# EAGLE design BRPBARS4CH (EAGLE 9.6.2)
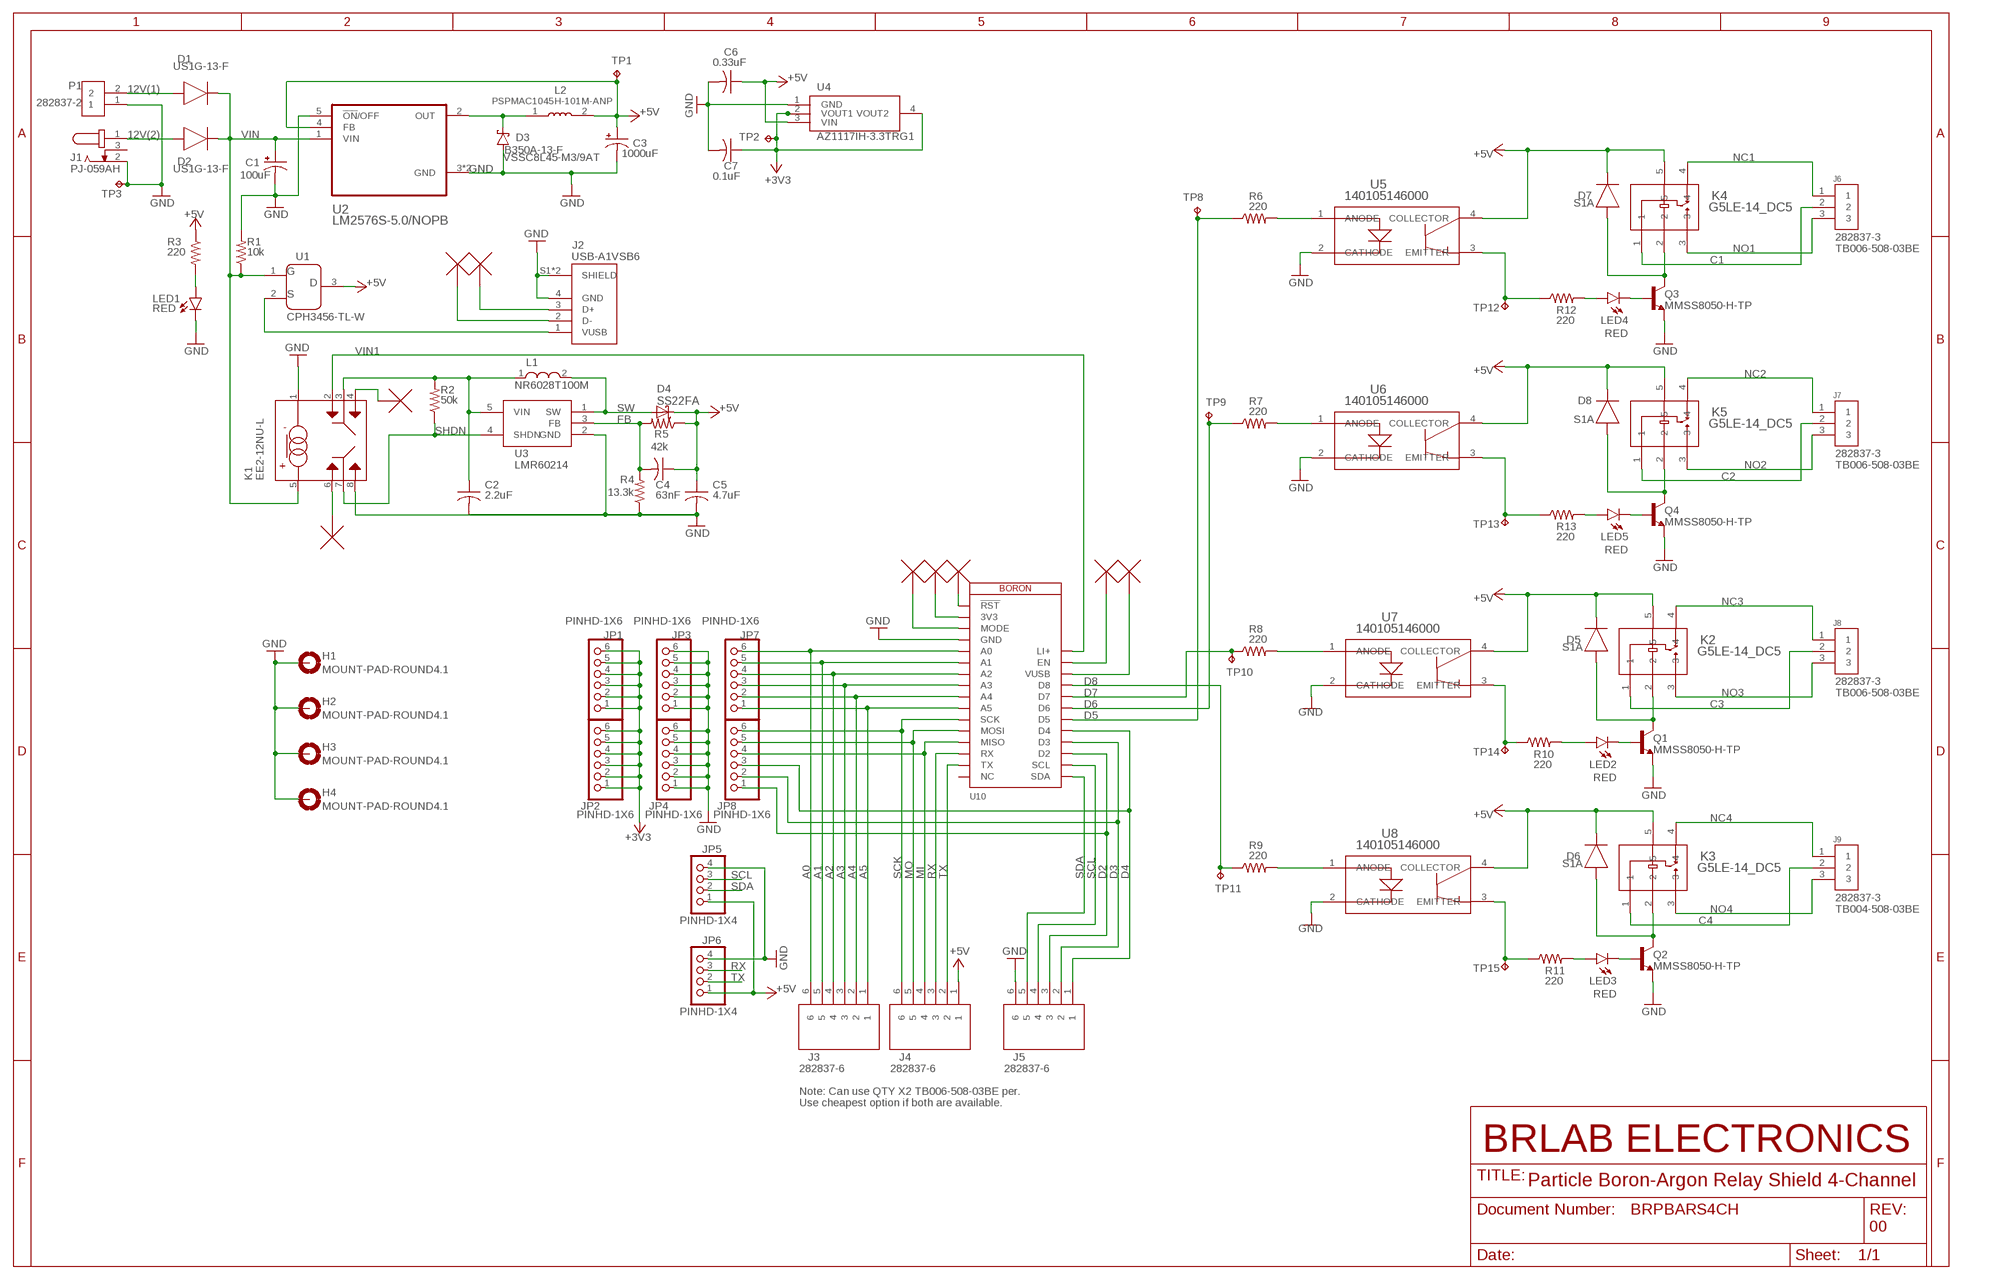
[diagram p0: schematic, sheet 1]

## Parts
C1  100uF  CPOL-US153CLV-0605  [153CLV-0605]
C2  2.2uF  C-USC0805  [C0805]
C3  1000uF  CPOL-US153CLV-0810  [153CLV-0810]
C4  63nF  C-USC0805  [C0805]
C5  4.7uF  C-USC0805  [C0805]
C6  0.33uF  C-USC1206  [C1206]
C7  0.1uF  C-USC1206  [C1206]
D1  RS1G-13-F  DIODE_RS1G-13-F_SMA  [DIOM5226X290N]
D2  RS1G-13-F  DIODE_RS1G-13-F_SMA  [DIOM5226X290N]
D3  B350A-13-F  SCHOTTKY-DIODESMD  [SMB]
D4  SS22FA  [SS22FA]
D5  DIODE  DIODEDO-214AC(SMA)  [DIOM5226X290N]
D6  DIODE  DIODEDO-214AC(SMA)  [DIOM5226X290N]
D7  DIODE  DIODEDO-214AC(SMA)  [DIOM5226X290N]
D8  DIODE  DIODEDO-214AC(SMA)  [DIOM5226X290N]
H1  MOUNT-PAD-ROUND4.1  [4,1-PAD]
H2  MOUNT-PAD-ROUND4.1  [4,1-PAD]
H3  MOUNT-PAD-ROUND4.1  [4,1-PAD]
H4  MOUNT-PAD-ROUND4.1  [4,1-PAD]
J1  PJ-059AH  [CUI_PJ-059AH]
J2  USB-A1VSB6  [ONSHORE_USB-A1VSB6]
J3  282837-6  [TE_282837-6]
J4  282837-6  [TE_282837-6]
J5  282837-6  [TE_282837-6]
J6  282837-3  [TE_282837-3]
J7  282837-3  [TE_282837-3]
J8  282837-3  [TE_282837-3]
J9  282837-3  [TE_282837-3]
JP1  PINHD-1X6  [1X06]
JP2  PINHD-1X6  [1X06]
JP3  PINHD-1X6  [1X06]
JP4  PINHD-1X6  [1X06]
JP5  PINHD-1X4  [1X04]
JP6  PINHD-1X4  [1X04]
JP7  PINHD-1X6  [1X06]
JP8  PINHD-1X6  [1X06]
K1  EE2-12NU-L  [EE2-12NU-L]
K2  G5LE-14_DC5  [RELAY_G5LE-1_DC5_OMR]
K3  G5LE-14_DC5  [RELAY_G5LE-1_DC5_OMR]
K4  G5LE-14_DC5  [RELAY_G5LE-1_DC5_OMR]
K5  G5LE-14_DC5  [RELAY_G5LE-1_DC5_OMR]
L1  NR6028T100M  [NR6028T100M]
L2  100uH  PSPMAC1045H-101M-ANP  [PSPMAC1045H-101M-ANP]
LED1  RED  LEDCHIPLED_1206  [CHIPLED_1206]
LED2  RED  LEDCHIPLED_1206  [CHIPLED_1206]
LED3  RED  LEDCHIPLED_1206  [CHIPLED_1206]
LED4  RED  LEDCHIPLED_1206  [CHIPLED_1206]
LED5  RED  LEDCHIPLED_1206  [CHIPLED_1206]
NC1  NC_MARKER  (no package)
NC2  NC_MARKER  (no package)
NC3  NC_MARKER  (no package)
NC4  NC_MARKER  (no package)
P1  282837-2  [TE_282837-2]
Q1  MMSS8050-H-TP  [TRANS_MMSS8050-H-TP]
Q2  MMSS8050-H-TP  [TRANS_MMSS8050-H-TP]
Q3  MMSS8050-H-TP  [TRANS_MMSS8050-H-TP]
Q4  MMSS8050-H-TP  [TRANS_MMSS8050-H-TP]
R1  10k  R-US_R1206  [R1206]
R2  50k  R-US_R0805  [R0805]
R3  220  R-US_R1206  [R1206]
R4  13.3k  R-US_R0805  [R0805]
R5  42k  R-US_R0805  [R0805]
R6  220  R-US_R1206  [R1206]
R7  220  R-US_R1206  [R1206]
R8  220  R-US_R1206  [R1206]
R9  220  R-US_R1206  [R1206]
R10  220  R-US_R1206  [R1206]
R11  220  R-US_R1206  [R1206]
R12  220  R-US_R1206  [R1206]
R13  220  R-US_R1206  [R1206]
TP1  TPB1,27  [B1,27]
TP2  TPB1,27  [B1,27]
TP3  TPB1,27  [B1,27]
TP8  TPB1,27  [B1,27]
TP9  TPB1,27  [B1,27]
TP10  TPB1,27  [B1,27]
TP11  TPB1,27  [B1,27]
TP12  TPB1,27  [B1,27]
TP13  TPB1,27  [B1,27]
TP14  TPB1,27  [B1,27]
TP15  TPB1,27  [B1,27]
U1  CPH3456-TL-W  [CPH3456-TL-W]
U2  LM2576S-5.0/NOPB  [VREG_TPS79625KTTR]
U3  LMR60214  [SOT95P280X145-5N]
U4  AZ1117IH-3.3TRG1  [SOT223]
U5  140105146000  [SO_5146000_WRE]
U6  140105146000  [SO_5146000_WRE]
U7  140105146000  [SO_5146000_WRE]
U8  140105146000  [SO_5146000_WRE]
U10  BORON  [BORON]
U$1  NC_MARKER  (no package)
U$2  NC_MARKER  (no package)
U$3  NC_MARKER  (no package)
U$4  NC_MARKER  (no package)
U$5  NC_MARKER  (no package)

## Nets
12V(1): D1.2(A) P1.2
12V(2): D2.2(A) J1.1
+3V3: C7.1 JP1.1 JP1.2 JP1.3 JP1.4 JP1.5 JP1.6 JP2.1 JP2.2 JP2.3 JP2.4 JP2.5 JP2.6 TP2.TP U4.2(VOUT1) U4.4(VOUT2)
+5V: C3.+ C4.1 C5.1 C6.1 D4.2(C) D5.1(C) D6.1(C) D7.1(C) D8.1(C) J4.1 JP5.1 JP6.1 K2.5 K3.5 K4.5 K5.5 L2.2 R3.1 R5.1 TP1.TP U1.3 U2.4(FB) U4.3(VIN) U5.4(COLLECTOR) U6.4(COLLECTOR) U7.4(COLLECTOR) U8.4(COLLECTOR)
A0: J3.6 JP7.6 U10.5(A0)
A1: J3.5 JP7.5 U10.6(A1)
A2: J3.4 JP7.4 U10.7(A2)
A3: J3.3 JP7.3 U10.8(A3)
A4: J3.2 JP7.2 U10.9(A4)
A5: J3.1 JP7.1 U10.10(A5)
C1: J6.2 K4.1
C2: J7.2 K5.1
C3: J8.2 K2.1
C4: J9.2 K3.1
D2: J5.3 JP8.1 U10.19(D2)
D3: J5.2 JP8.2 U10.20(D3)
D4: J5.1 JP8.3 U10.21(D4)
D5: R6.1 TP8.TP U10.22(D5)
D6: R7.1 TP9.TP U10.23(D6)
D7: R8.1 TP10.TP U10.24(D7)
D8: R9.1 TP11.TP U10.25(D8)
FB: C4.2 R4.2 R5.2 U3.3(FB)
GND [New Class]: C1.- C2.2 C3.- C5.2 C6.2 C7.2 D3.A H1.B4,1(MOUNT) H2.B4,1(MOUNT) H3.B4,1(MOUNT) H4.B4,1(MOUNT) J1.2 J2.4(GND) J2.S1(SHIELD) J2.S2(SHIELD) J5.6 JP3.1 JP3.2 JP3.3 JP3.4 JP3.5 JP3.6 JP4.1 JP4.2 JP4.3 JP4.4 JP4.5 JP4.6 JP5.4 JP6.4 K1.1 K1.8 LED1.C P1.1 Q1.2(E) Q2.2(E) Q3.2(E) Q4.2(E) R1.2 R4.1 TP3.TP U2.3(GND) U2.5(!ON!/OFF) U2.6(GND) U3.2(GND) U4.1(GND) U5.2(CATHODE) U6.2(CATHODE) U7.2(CATHODE) U8.2(CATHODE) U10.4(GND)
MI: J4.4 JP8.4 U10.13(MISO)
MO: J4.5 JP8.5 U10.12(MOSI)
N$1: R12.1 TP12.TP U5.3(EMITTER)
N$2: LED2.A R10.2
N$3: D7.2(A) K4.2 Q3.3(C)
N$4: LED4.C Q3.1(B)
N$5: LED5.C Q4.1(B)
N$6: D8.2(A) K5.2 Q4.3(C)
N$7: LED3.A R11.2
N$8: LED4.A R12.2
N$9: R9.2 U8.1(ANODE)
N$10: R8.2 U7.1(ANODE)
N$11: C2.1 K1.3 L1.1 R2.2 U3.5(VIN)
N$12: LED5.A R13.2
N$13: R11.1 TP15.TP U8.3(EMITTER)
N$14: R10.1 TP14.TP U7.3(EMITTER)
N$15: R6.2 U5.1(ANODE)
N$16: K1.4 NC1.P$1
N$17: U10.27(EN) U$4.P$1
N$18: U10.1(!RST) U$1.P$1
N$19: R13.1 TP13.TP U6.3(EMITTER)
N$20: U10.26(VUSB) U$5.P$1
N$21: LED1.A R3.2
N$22: U10.2(3V3) U$2.P$1
N$23: U10.3(MODE) U$3.P$1
N$24: J2.1(VUSB) U1.2
N$25: D5.2(A) K2.2 Q1.3(C)
N$26: K1.6 NC2.P$1
N$27: J2.3(D+) NC3.P$1
N$28: R7.2 U6.1(ANODE)
N$29: LED2.C Q1.1(B)
N$30: J2.2(D-) NC4.P$1
N$31: LED3.C Q2.1(B)
N$32: D6.2(A) K3.2 Q2.3(C)
NC1: J6.1 K4.4
NC2: J7.1 K5.4
NC3: J8.1 K2.4
NC4: J9.1 K3.4
NO1: J6.3 K4.3
NO2: J7.3 K5.3
NO3: J8.3 K2.3
NO4: J9.3 K3.3
OUT: D3.C L2.1 U2.2(OUT)
RX: J4.3 JP6.3 U10.14(RX)
SCK: J4.6 JP8.6 U10.11(SCK)
SCL: J5.4 JP5.3 U10.18(SCL)
SDA: J5.5 JP5.2 U10.17(SDA)
SHDN: K1.7 R2.1 U3.4(SHDN)
SW: D4.1(A) L1.2 U3.1(SW)
TX: J4.2 JP6.2 U10.15(TX)
VIN: C1.+ D1.1(C) D2.1(C) K1.5 R1.1 U1.1 U2.1(VIN)
VIN1: K1.2 U10.28(LI+)
Unconnected: J1.3 U10.16(NC)

## Notes on the sheet
- US1G-13-F
- PSPMAC1045H-101M-ANP
- VSSC8L45-M3/9AT
- US1G-13-F
- S1A
- 282837-3
- TB006-508-03BE
- S1A
- 282837-3
- TB006-508-03BE
- S1A
- 282837-3
- TB006-508-03BE
- S1A
- 282837-3
- TB004-508-03BE
- Note: Can use QTY X2 TB006-508-03BE per.
- Use cheapest option if both are available.
- BRLAB ELECTRONICS
- Particle Boron-Argon Relay Shield 4-Channel
- 00

## Library data of the parts
C1 C3 = rcl:CPOL-US: POLARIZED CAPACITOR, American symbol; SPICEPREFIX: C
C2 C4-C7 = rcl:C-US: CAPACITOR, American symbol; SPICEPREFIX: C
D1 D2 = Diode:DIODE_: Diode Rectifier - Popular parts; CATEGORY: Diode; DESCRIPTION: DIODE GEN PURP 400V 1A SMA; SUB-CATEGORY: Rectifier
D3 = diode:SCHOTTKY-DIODE: Schottky Diode
D4 = Diodes Schottky:SS22FA
D5-D8 = Diode:DIODE: Diode Rectifier - Generic; CATEGORY: Diode; SUB-CATEGORY: Rectifier
H1-H4 = holes:MOUNT-PAD-ROUND: MOUNTING PAD, round
J1 = PJ-059AH:PJ-059AH: 2.0 mm Center Pin, 5.0 A, Right Angle, Through Hole, Tapered Pins, Locking Type, Dc Power Jack Connector; CUI_PURCHASE_URL: https://www.cuidevices.com/product/interconnect/connectors/dc-power-connectors/jacks/pj-059ah?utm_source=snapeda.com&utm_medium=referral&utm_campaign=snapedaBOM; DESCRIPTION: 2.0 x 5.7 mm, 5.0 A, Horizontal, Through Hole, Tapered Pins, Locking Type, Dc Power Jack Connector; DIGI-KEY_PART_NUMBER: CP-059AH-ND; MF: CUI Devices; MP: PJ-059AH; PACKAGE: None
J2 = USB-A:USB-A1VSB6: Conn Usb Type a Vertical Black; DESCRIPTION: USB-A (USB TYPE-A) Receptacle Connector 4 Position Through Hole; DIGI-KEY_PART_NUMBER: ED3075-ND; MF: On Shore; MP: USB-A1VSB6; PACKAGE: None; PURCHASE-URL: https://pricing.snapeda.com/search/part/USB-A1VSB6/?ref=eda
J3-J5 = TE 282837 Series Screw Term BLK:282837-6; COMMENT: 282837-6; DESCRIPTION: Conn Terminal Block F 6 POS 5.08mm Solder ST Thru-Hole 13.5A/Contact; DIGI-KEY_PART_NUMBER: A113322-ND; EU_ROHS_COMPLIANCE: Compliant with Exemptions; MF: TE Connectivity; MP: 282837-6; PACKAGE: None; PURCHASE-URL: https://pricing.snapeda.com/search/part/282837-6/?ref=eda
J6-J9 = TE 282837 Series Screw Term BLK:282837-3: TERMI-BLOK PCB MOUNT 3P; COMMENT: 282837-3
JP1-JP4 JP7 JP8 = Male PH:PINHD-1X6: PIN HEADER; CATEGORY: CONNECTOR; SUB-CATEGORY: PIN-HEADER
JP5 JP6 = Connector:PINHD-1X4: PIN HEADER; CATEGORY: CONNECTOR; SUB-CATEGORY: PIN-HEADER
K1 = RELAYS:EE2-12NU-L
K2-K5 = RELAYS:G5LE-14_DC5; BUILT_BY: EMA_Justin; COPYRIGHT: Copyright (C) 2018 Accelerated Designs. All rights reserved; MANUFACTURER_PART_NUMBER: G5LE-14 DC5; SOURCELIBRARY: Omron_2020-03-12; VENDOR: Omron
L1 = Inductors:NR6028T100M
L2 = Inductors:PSPMAC1045H-101M-ANP
LED1-LED5 = led:LED: LED OSRAM: - CHIPLED LG R971, LG N971, LY N971, LG Q971, LY Q971, LO R971, LY R971 LH N974, LH R974 LS Q976, LO Q976, LY Q976 LO Q996 - Hyper CHIPLED LW Q18S LB Q993, LB Q99A, LB R99A - SideLED LS A670, LO A670, LY A670, LG A670, LP A670 LB A673, LV A673, LT A673, LW A673 LH A674 LY A675 LS A676, LA A676, LO A676, LY A676, LW A676 LS A679, LY A679, LG A679 - Hyper Micro SIDELED® LS Y876, LA Y876, LO Y876, LY Y876 LT Y87S - SmartLED LW L88C, LW L88S LB L89C, LB L89S, LG L890 LS L89K, LO L89K, LY L89K LS L896, LA L896, LO L896, LY L896 - TOPLED LS T670, LO T670, LY T670, LG T670, LP T670 LSG T670, LSP T670, LSY T670, LOP T670, LYG T670 LG T671, LOG T671, LSG T671 LB T673, LV T673, LT T673, LW T673 LH T674 LS T676, LA T676, LO T676, LY T676, LB T676, LH T676, LSB T676, LW T676 LB T67C, LV T67C, LT T67C, LS T67K, LO T67K, LY T67K, LW E67C LS E67B, LA E67B, LO E67B, LY E67B, LB E67C, LV E67C, LT E67C LW T67C LS T679, LY T679, LG T679 LS T770, LO T770, LY T770, LG T770, LP T770 LB T773, LV T773, LT T773, LW T773 LH T774 LS E675, LA E675, LY E675, LS T675 LS T776, LA T776, LO T776, LY T776, LB T776 LHGB T686 LT T68C, LB T68C - Hyper Mini TOPLED® LB M676 - Mini TOPLED Santana® LG M470 LS M47K, LO M47K, LY M47K Source: http://www.osram.convergy.de LUXEON: - LUMILED® LXK2-PW12-R00, LXK2-PW12-S00, LXK2-PW14-U00, LXK2-PW14-V00 LXK2-PM12-R00, LXK2-PM12-S00, LXK2-PM14-U00 LXK2-PE12-Q00, LXK2-PE12-R00, LXK2-PE12-S00, LXK2-PE14-T00, LXK2-PE14-U00 LXK2-PB12-K00, LXK2-PB12-L00, LXK2-PB12-M00, LXK2-PB14-N00, LXK2-PB14-P00, LXK2-PB14-Q00 LXK2-PR12-L00, LXK2-PR12-M00, LXK2-PR14-Q00, LXK2-PR14-R00 LXK2-PD12-Q00, LXK2-PD12-R00, LXK2-PD12-S00 LXK2-PH12-R00, LXK2-PH12-S00 LXK2-PL12-P00, LXK2-PL12-Q00, LXK2-PL12-R00 Source: www.luxeon.com KINGBRIGHT: KA-3528ASYC Source: www.kingbright.com
NC1-NC4 U$1-U$5 = NC_MARKER:NC_MARKER
P1 = TE 282837 Series Screw Term BLK:282837-2: TERM BLOCK 5.08MM 2POS SIDE ENTY; COMMENT: 282837-2; DESCRIPTION: Connector Terminal Blocks Receptacle 2 Position 5.08mm Solder Straight Thru-Hole 13.5A/Contact; DIGI-KEY_PART_NUMBER: A113320-ND; MF: TE Connectivity; MP: 282837-2; PACKAGE: None; PURCHASE-URL: https://pricing.snapeda.com/search/part/282837-2/?ref=eda
Q1-Q4 = NPN Transistors:MMSS8050-H-TP: MMSS8050-H Series 25 V 1.5 A NPN Silicon Plastic-Encapsulate Transistor-SOT-23; DESCRIPTION: Bipolar (BJT) Transistor NPN 25V 1.5A 100MHz 625mW Surface Mount SOT-23; DIGI-KEY_PART_NUMBER: MMSS8050-H-TPMSCT-ND; MF: Micro Commercial; MP: MMSS8050-H-TP; PACKAGE: SOT-23 MCC
R1 = rcl:R-US_: RESISTOR, 1206, American symbol; PACKAGE: 1206; SPICEPREFIX: R
R2 R4 R5 = rcl:R-US_: RESISTOR, 1206, American symbol; SPICEPREFIX: R
R3 = rcl:R-US_: RESISTOR, American symbol; PACKAGE: 1206; SPICEPREFIX: R
R6-R13 = rcl:R-US_: RESISTOR, American symbol; SPICEPREFIX: R
TP1-TP3 TP8-TP15 = testpad:TP: Test pad
U1 = N-CH MOSFETS:CPH3456-TL-W
U2 = Buck Converter IC:LM2576S-5.0/NOPB: Check prices <https://pricing.snapeda.com/search/part/LM2576S-5.0/?ref=eda>; AVAILABILITY: Warning; DESCRIPTION: SIMPLE SWITCHER&reg; 40V, 3A Low Component Count Step-Down Regulator 5-DDPAK/TO-263 -40 to 125; MF: Texas Instruments; MP: LM2576S-5.0; PACKAGE: TO-263-5 Texas Instruments; PRICE: None; PURCHASE-URL: https://pricing.snapeda.com/search/part/LM2576S-5.0/?ref=eda
U3 = LMR62014:LMR60214
U4 = AZ1117IH-3.3TRG1:AZ1117IH-3.3TRG1: Check prices <https://pricing.snapeda.com/parts/AZ1117IH-3.3TRG1/Diodes%20Inc./view-part?ref=eda>; AVAILABILITY: Warning; DESCRIPTION: Linear Voltage Regulator IC Positive Fixed 1 Output 1A SOT-223; MF: Diodes Inc.; MP: AZ1117IH-3.3TRG1; PACKAGE: SOT-223 Diodes Inc.; PRICE: None; PURCHASE-URL: https://pricing.snapeda.com/search/part/AZ1117IH-3.3TRG1/?ref=eda
U5-U8 = Optocouplers:140105146000; COPYRIGHT: Copyright (C) 2021 Ultra Librarian. All rights reserved.; DIGI-KEY_PART_NUMBER_1: 732-140105146000TR-ND; DIGI-KEY_PART_NUMBER_2: 732-140105146000CT-ND; DIGI-KEY_PART_NUMBER_3: 732-140105146000DKR-ND; MANUFACTURER_PART_NUMBER: 140105146000; MFR_NAME: Wurth Electronics
U10 = Particle-Devices:BORON: BORON The Particle Boron cellular enabled development kit that can act as either a standalone cellular device or LTE enabled gateway, repeater, or endpoint for a Particle Mesh networks. More information: https://docs.particle.io/boron/ Footprint and formfactor based on Adafruit Feather. <https://www.adafruit.com/feather>

## Board
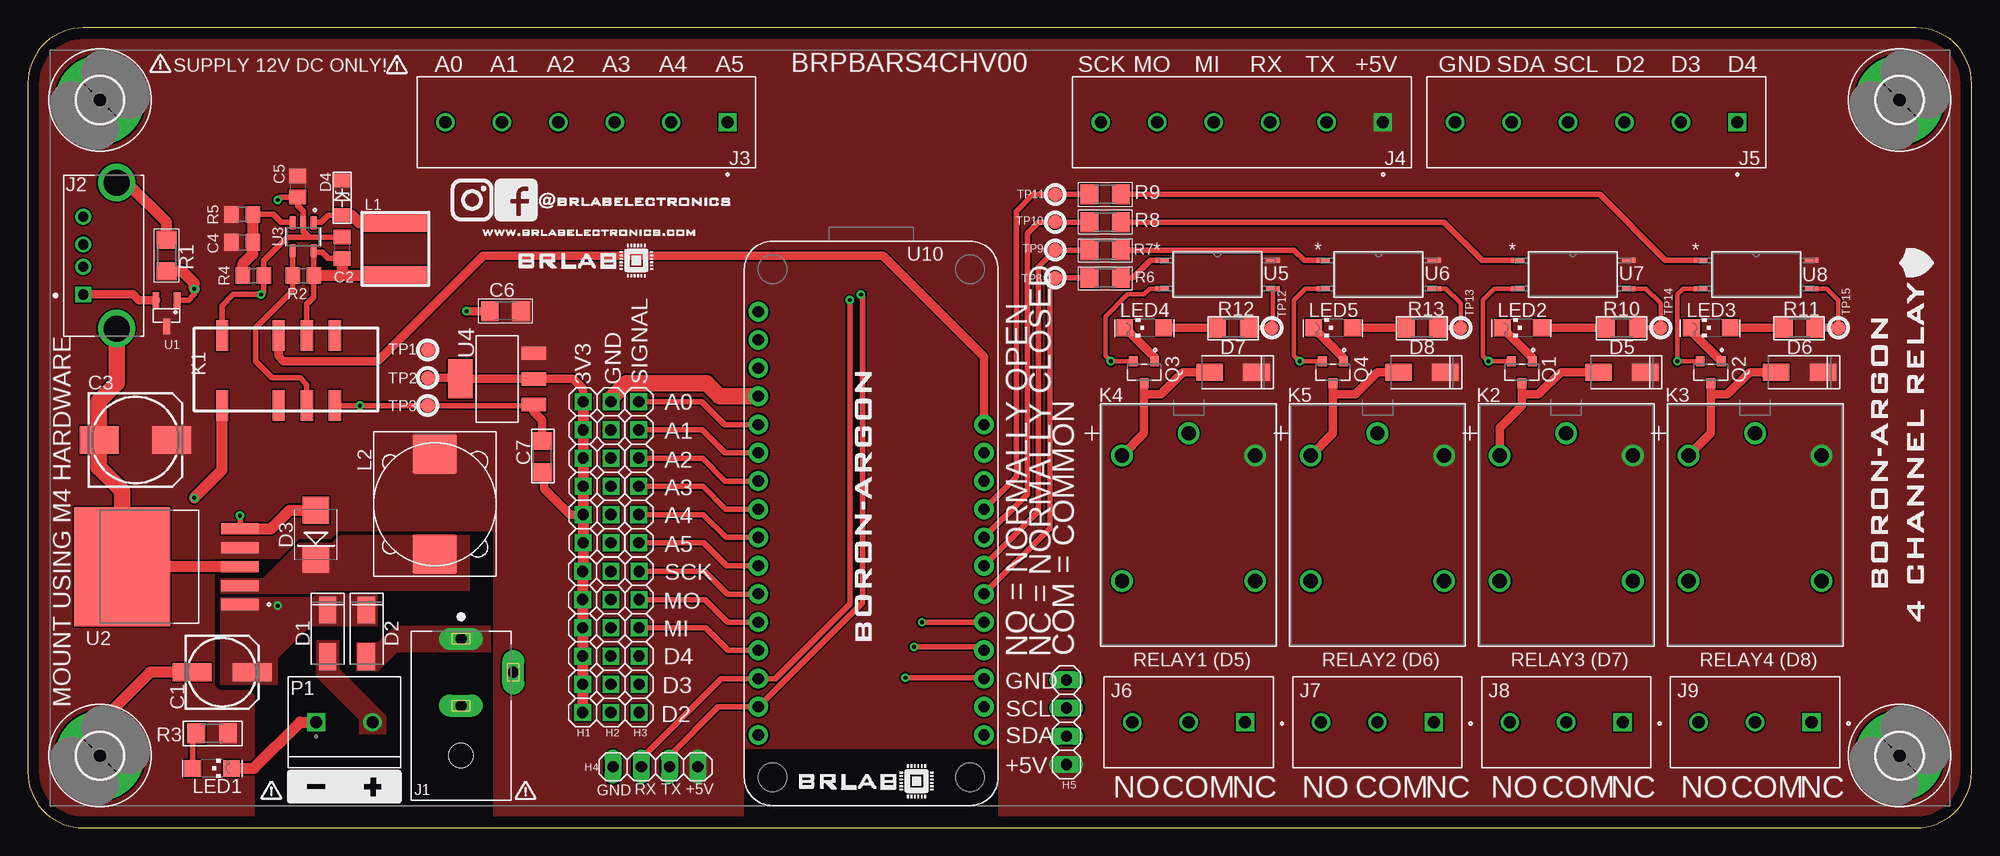
[diagram p1: board, top side]
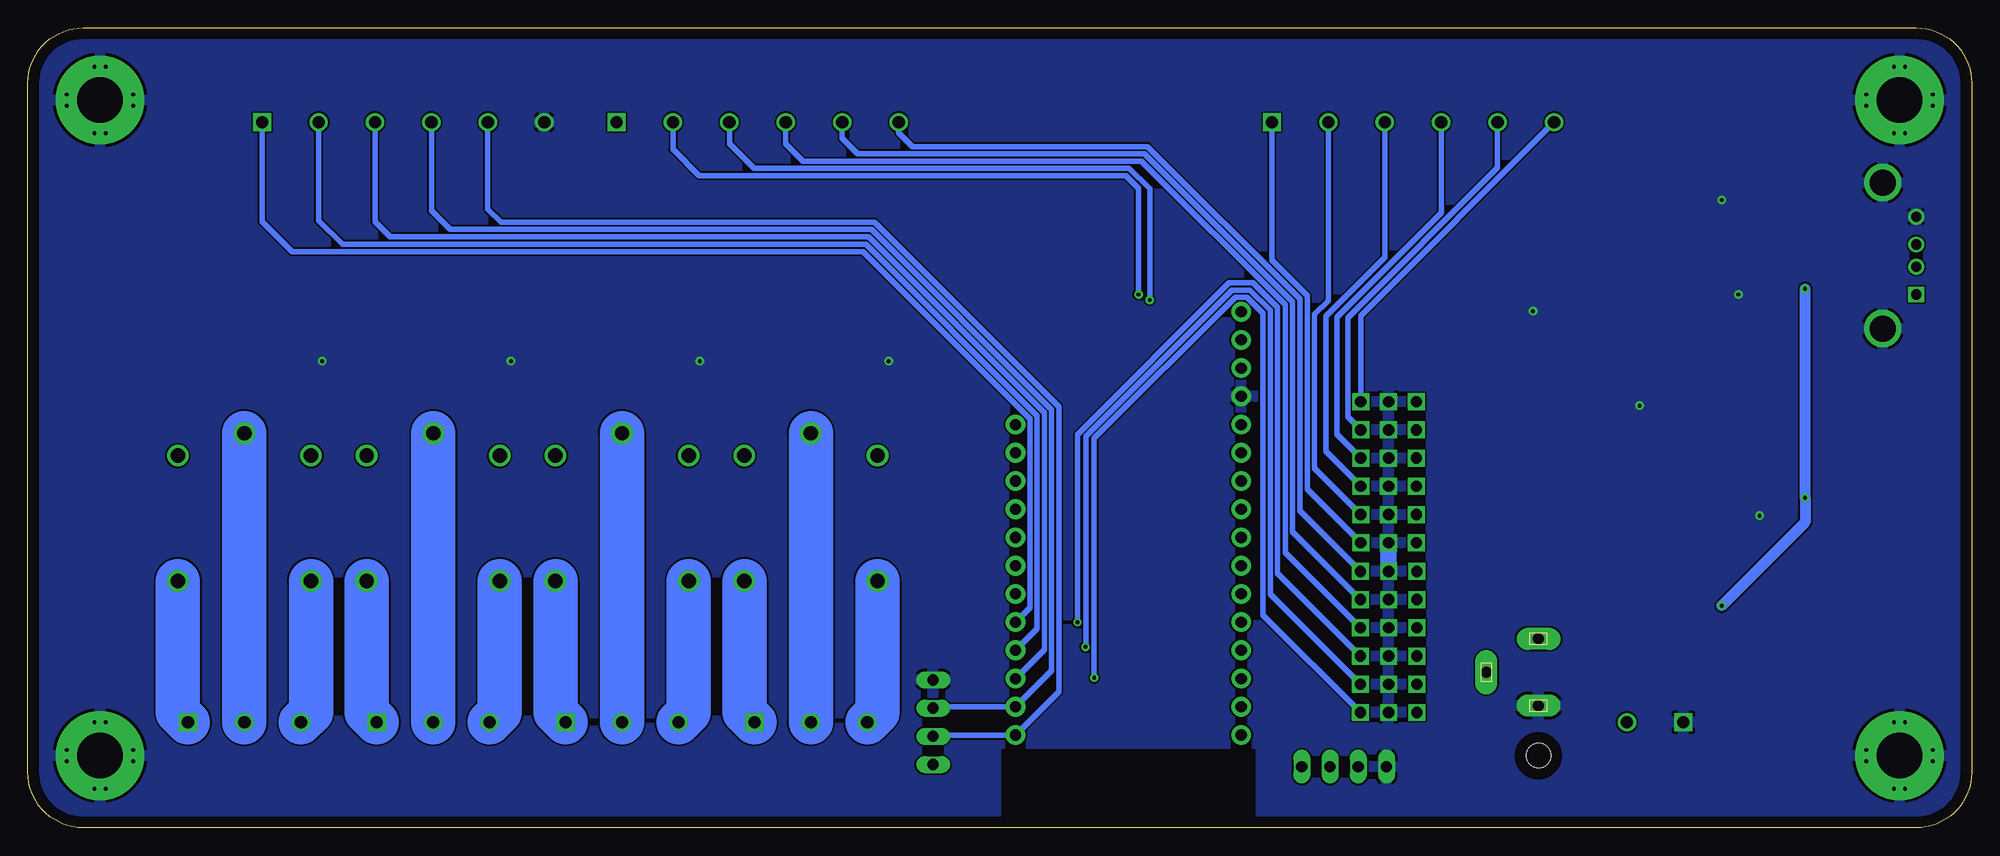
[diagram p2: board, bottom side, seen from below]

Size 175 x 72 mm. Coordinates in mm from the lower left corner, seen from the top.
Outline: 5,0 170,0 arc90 175,5 175,67 arc90 170,72 5,72 arc90 0,67 0,5 arc90 5,0
Copper layers (1*16): Top 0.035mm / dielectric 1.5mm / Bottom 0.035mm
Design rules "default *": minimum track width 6mil, minimum drill 0.35mm, track to track 6mil, track to pad 6mil, pad to pad 6mil, via to via 6mil, smd to smd 6mil, copper to edge 40mil, drill to drill 6mil, minimum pad ring 10mil, minimum via ring 8mil, stop-mask expansion 4mil, vias tented up to drill 0mil, thermal gap 10mil

### Footprints (pad centres in the part's own frame; a part is rotated, then mirrored left to right if it is on the bottom)
153CLV-0605 = smd 3.5 x 1.6: + 2.7,0; - -2.7,0
C0805 = smd 1.3 x 1.5: 1 -0.95,0; 2 0.95,0
153CLV-0810 = smd 3.5 x 2.5: + 3.25,0; - -3.25,0
C1206 = smd 1.6 x 1.8: 1 -1.4,0; 2 1.4,0
DIOM5226X290N = smd 2.392 x 1.565: 1 -2.108,0; 2 2.108,0
SMB = smd 2.4 x 2.4: A 2.2,0; C -2.2,0
SS22FA = smd 1.2 x 1.4: 1 -1.55,0; 2 1.55,0
4,1-PAD = drill 4.1 pad 8: B4,1 0,0
CUI_PJ-059AH = drill 1 pad 2 long: 1 0,0; 2 6,0; 3 3,4.7 | hole 2.2: 10.5,0
ONSHORE_USB-A1VSB6 = drill 0.92 square: 1 -3.5,3 | drill 0.92: 2 -1,3; 3 1,3; 4 3.5,3 | drill 2.33: S1 -6.57,0; S2 6.57,0
TE_282837-6 = drill 1.1 square: 1 -12.7,0 | drill 1.1: 2 -7.62,0; 3 -2.54,0; 4 2.54,0; 5 7.62,0; 6 12.7,0
TE_282837-3 = drill 1.1 square: 1 -5.08,0 | drill 1.1: 2 0,0; 3 5.08,0
1X06 = drill 1.016 square: 1 -6.35,0; 2 -3.81,0; 3 -1.27,0; 4 1.27,0; 5 3.81,0; 6 6.35,0
1X04 = drill 1.016 long: 1 -3.81,0; 2 -1.27,0; 3 1.27,0; 4 3.81,0
EE2-12NU-L = smd 1.11 x 2.75: 1 0,6.29; 2 5.08,6.29; 3 7.62,6.29; 4 10.16,6.29; 5 0,0; 6 5.08,0; 7 7.62,0; 8 10.16,0
RELAY_G5LE-1_DC5_OMR = drill 1.295 pad 1.803: 1 0,16.51; 2 -5.994,14.503; 3 -5.994,3.2; 4 5.994,3.2; 5 5.994,14.503
NR6028T100M = smd 1.6 x 5.7: 1 -2.35,0; 2 2.35,0
PSPMAC1045H-101M-ANP = smd 3.5 x 4: 1 -4.5,0; 2 4.5,0
CHIPLED_1206 = smd 1.5 x 1.5: A 0,-1.75; C 0,1.75
TE_282837-2 = drill 1.1 square: 1 -2.54,0 | drill 1.1: 2 2.54,0
TRANS_MMSS8050-H-TP = smd 0.9 x 0.8: 1 -1,0.95; 2 -1,-0.95; 3 1,0
R1206 = smd 1.6 x 1.803: 1 -1.422,0; 2 1.422,0
R0805 = smd 1.3 x 1.5: 1 -0.95,0; 2 0.95,0
B1,27 = smd 1.27 x 1.27: TP 0,0
CPH3456-TL-W = smd 0.6 x 1.4: 1 -0.95,0; 2 0.95,0; 3 0,2.4
VREG_TPS79625KTTR = smd 3.4 x 1: 1 -10.6,3.4; 2 -10.6,1.7; 3 -10.6,0; 4 -10.6,-1.7; 5 -10.6,-3.4 | smd 8.6 x 10.7: 6 0,0
SOT95P280X145-5N = smd 1.21 x 0.59: 1 -1.255,0.95; 2 -1.255,0; 3 -1.255,-0.95; 4 1.255,-0.95; 5 1.255,0.95
SOT223 = smd 2.2 x 1.2: 1 -3.3,2.3; 2 -3.3,0; 3 -3.3,-2.3 | smd 2.2 x 3.5: 4 3.3,0
SO_5146000_WRE = smd 1.219 x 0.457: 1 -4.991,1.27; 2 -4.991,-1.27; 3 4.991,-1.27; 4 4.991,1.27
BORON = drill 1 pad 1.778: 1 1.27,44.45; 2 1.27,41.91; 3 1.27,39.37; 4 1.27,36.83; 5 1.27,34.29; 6 1.27,31.75; 7 1.27,29.21; 8 1.27,26.67; 9 1.27,24.13; 10 1.27,21.59; 11 1.27,19.05; 12 1.27,16.51; 13 1.27,13.97; 14 1.27,11.43; 15 1.27,8.89; 16 1.27,6.35; 17 21.59,6.35; 18 21.59,8.89; 19 21.59,11.43; 20 21.59,13.97; 21 21.59,16.51; 22 21.59,19.05; 23 21.59,21.59; 24 21.59,24.13; 25 21.59,26.67; 26 21.59,29.21; 27 21.59,31.75; 28 21.59,34.29

### Placement (x,y rotation side)
C1  17.5,14 0 top
C2  28.3,52.2 90 top
C3  9.7,34.9 0 top
C4  19.3,52.7 0 top
C5  24.3,57.7 270 top
C6  43,46.5 180 top
C7  46.31,33.41 90 top
D1  27,17.5 270 top
D2  30.5,17.5 270 top
D3  25.93,26.37 90 top
D4  28.3,56.7 90 top
D5  143.5,41 180 top
D6  159.5,41 180 top
D7  108.5,41 180 top
D8  125.5,41 180 top
H1  6.5,6.5 0 top
H2  6.5,65.5 0 top
H3  168.5,6.5 0 top
H4  168.5,65.5 0 top
J1  39,17 270 top
J2  8,51.5 90 top
J3  50.3,63.5 180 top
J4  109.3,63.5 180 top
J5  141.2,63.5 180 top
J6  104.5,9.5 180 top
J7  121.5,9.5 180 top
J8  138.5,9.5 180 top
J9  155.5,9.5 180 top
JP1  50,32 90 top
JP2  49.95,16.73 90 top
JP3  52.5,32 270 top
JP4  52.49,16.73 270 top
JP5  93.5,9.5 90 top
JP6  56.5,5.5 180 top
JP7  55,32 90 top
JP8  55.04,16.73 90 top
K1  17.5,38 0 top
K2  138.5,19 0 top
K3  155.5,19 0 top
K4  104.5,19 0 top
K5  121.5,19 0 top
L1  33.1,52.1 90 top
L2  36.64,29.12 90 top
LED1  16.6,5.35 270 top
LED2  134.5,45 90 top
LED3  151.5,45 90 top
LED4  100.5,45 90 top
LED5  117.5,45 90 top
P1  28.5,9.5 0 top
Q1  134.5,41 270 top
Q2  151.5,41 270 top
Q3  100.5,41 270 top
Q4  117.5,41 270 top
R1  12.5,51.5 90 top
R2  24.8,49.7 0 top
R3  16.6,8.5 180 top
R4  20.3,49.7 180 top
R5  19.3,55.2 0 top
R6  97,49.5 0 top
R7  97,52 0 top
R8  97,54.5 0 top
R9  97,57 0 top
R10  143.5,45 180 top
R11  159.5,45 180 top
R12  108.5,45 180 top
R13  125.5,45 180 top
TP1  36,43 0 top
TP2  36,40.5 270 top
TP3  36,38 0 top
TP8  92.5,49.5 180 top
TP9  92.5,52 0 top
TP10  92.5,54.5 0 top
TP11  92.5,57 0 top
TP12  112,45 0 top
TP13  129,45 0 top
TP14  147,45 0 top
TP15  163,45 0 top
U1  12.5,47.5 180 top
U2  8.5,23.5 180 top
U3  24.8,53.2 270 top
U4  42.25,40.4 180 top
U5  107.1,49.8 0 top
U6  121.6,49.8 0 top
U7  139.1,49.8 0 top
U8  155.6,49.8 0 top
U10  64.5,2 0 top

### Tracks (layer width: path | path; a pad name or v marks a point on that pad's centre or on a via)
12V(1)
  pour Top (no thermals): 26,16.9 28,16.9 28,14.3 32.2,10.1 32.2,8.4 29.9,8.4 29.9,9.7 26,13.6
12V(2)
  pour Top (no thermals): 29.6,16.7 31.6,16.7 33.1,18.2 41.6,18.2 41.6,15.8 33.2,15.8 31.5,14.1 29.6,14.1
+3V3
  Top 0.75: TP2.TP 38.85,40.5 U4.4 U4.2 49.1,40.4 50,39.5 JP1.6 | C7.1 46.5,31.82 46.5,30.5 48.81,28.19 JP1.2
  Top 1: JP1.6 JP1.5 JP1.4 JP1.3 JP1.2 JP1.1 50,23.13 JP2.6 JP2.5 JP2.4 JP2.3 JP2.2 JP2.1
+5V
  pour Top (no thermals): 0,0 0,72.2 -0.1,72.3 175.8,72.3 176.5,71.6 176.5,-0.4 176.6,-0.5 42,-0.5 42,26.7 27.9,26.7 27.2,26 24.4,26 22.6,24.2 16.8,24.2 16.8,12.8 17.2,12.4 19.9,12.4 20.4,11.9 20.4,-0.2 0.2,-0.2
A0
  Top 0.5: U10.5 62.71,36.29 60.65,38.35 JP7.6
  Bottom 0.5: J3.6 55,46.1 JP7.6
A1
  Top 0.5: U10.6 62.75,33.75 60.69,35.81 JP7.5
  Bottom 0.5: JP7.5 56.16,36.97 56.16,45.91 42.68,59.39 J3.5
A2
  Top 0.5: U10.7 62.79,31.21 60.73,33.27 JP7.4
  Bottom 0.5: JP7.4 57.15,35.42 57.15,45.95 47.76,55.34 J3.4
A3
  Top 0.5: U10.8 62.83,28.67 60.77,30.73 JP7.3
  Bottom 0.5: JP7.3 58.15,33.88 58.15,46.05 52.84,51.36 J3.3
A4
  Top 0.5: U10.9 62.87,26.13 60.81,28.19 JP7.2
  Bottom 0.5: JP7.2 59.15,32.34 59.15,46.22 57.92,47.45 J3.2
A5
  Top 0.5: U10.10 62.91,23.59 60.85,25.65 JP7.1
  Bottom 0.5: JP7.1 59.8,30.45 59.8,47.9 63,51.09 J3.1
C1
  Bottom 4: K4.1 J6.2
C2
  Bottom 4: K5.1 J7.2
C3
  Bottom 4: K2.1 J8.2
C4
  Bottom 4: K3.1 J9.2
D2  (via drill 0.35)
  Top 0.5: v79,13.5 86.02,13.5 U10.19
  Bottom 0.5: JP8.1 63.8,19.14 63.8,46.31 65.23,47.74 66.31,47.74 79,35.05 v79,13.5 | U10.19 83.49,16.03 83.49,37.37 99.32,53.2 142.38,53.2 143.74,54.55 J5.3
D3  (via drill 0.35)
  Top 0.5: v79.78,16.28 85.78,16.28 U10.20
  Bottom 0.5: v79.78,16.28 79.72,16.34 79.72,35.25 66.58,48.39 64.97,48.39 63.15,46.58 63.15,21.03 JP8.2 | U10.20 84.15,17.91 84.15,37.09 99.55,52.5 146.67,52.5 148.82,54.65 J5.2
D4  (via drill 0.35)
  Top 0.5: v80.5,18.5 v80.51,18.51 U10.21
  Bottom 0.5: v80.5,18.5 80.5,35.39 66.84,49.05 64.69,49.05 62.5,46.85 62.5,22.92 JP8.3 | U10.21 84.8,19.8 84.8,36.83 99.82,51.85 151.2,51.85 153.9,54.55 J5.1
D5
  Top 0.5: U10.22 92,26.96 92,49 TP8.TP 95.42,49.5 95.5,49.42 R6.1
D6
  Top 0.5: U10.23 91,28.5 91,50.5 TP9.TP R7.1
D7
  Top 0.5: R8.1 TP10.TP 91,54.5 90,53.5 90,30.04 U10.24
D8
  Top 0.5: U10.25 89,31.58 89,55.5 90.5,57 TP11.TP R9.1
FB
  Top 0.5: U3.3 23.8,54.5 22.8,54.5 22.1,55.2 R5.2
  Top 1: R5.2 C4.2 20.25,51.65 19.35,50.75 R4.2
GND  (via drill 0.35)
  Top 0.4: U5.2 101.03,48.53 100.5,48 99,48 97,46 97,42.5 v97.5,42 Q3.2 | U6.2 115.03,48.53 114,47.5 114,42.5 v114.5,42 Q4.2 | U7.2 132.03,48.53 131,47.5 131,42.5 v131.5,42 Q1.2 | U8.2 149.03,48.53 148.5,48 v148.5,42 Q2.2
  Top 0.5: C2.2 25.35,53.15 | 25.35,53.15 24.8,53.7 U3.2 24.8,55.5 24.3,56 C5.2 22.75,56.75 v22.5,56.5 | 25.35,53.15 23.35,53.15 21.25,51.05 R4.1 21.25,48.25 v21,48 18.5,48 17.5,47 K1.1 | 45.45,38 TP3.TP v29.9,38 K1.8 | v19.1,28.1 U2.5
  Top 0.75: C7.2 46.31,36.69 45.55,37.45 U4.1 45.45,38 | C6.2 v39.5,46.5
  Top 1: LED1.C 20.35,5.35 24.5,9.5 P1.1 | 8.5,22.4 U2.6 U2.3 | U2.5 21.9,26.9 23.57,28.57 D3.A | R1.2 12.5,54.5 8.93,58.07 J2.S2 | C1.- 11,14 6.5,9.5 H1.B4,1
  Top 1.5: U10.4 62.3,38.83 61.12,40.01 53.86,40.01 52.5,38.65 JP3.1 | J2.S1 8,40 6.4,38.4 6.4,34.85 | 8.5,21 8.5,30.32 6.42,32.4 6.4,32.4 6.4,34.85 | 6.4,34.85 C3.-
  Top 2: 8.5,22.4 8.5,21
  Bottom 1.5: JP3.6 JP4.1
  other vias: 6,9.5 7,9.5 9.5,7 9.5,6 3.5,6 3.5,7 6,3.5 7,3.5 6,68.5 7,68.5 9.5,66 3.5,66 3.5,65 6,62.5 7,62.5 9.5,65 168,9.5 169,9.5 171.5,7 171.5,6 169,3.5 168,3.5 165.5,6 165.5,7 168,68.5 169,68.5 171.5,66 165.5,66 165.5,65 168,62.5 169,62.5 171.5,65
  pour Bottom: 0,-0.1 0,73 175.1,73 176.1,72 176.1,-0.2 0.2,-0.2 0.1,-0.2
MI
  Top 0.5: U10.13 63.03,15.97 61,18 JP8.4
  Bottom 0.5: JP8.4 61.8,24.76 61.8,47.08 74.73,60 105.21,60 106.76,61.55 J4.4
MO
  Top 0.5: U10.12 63,18.5 60.96,20.54 JP8.5
  Bottom 0.5: JP8.5 61.15,26.65 61.15,47.35 74.46,60.65 100.28,60.65 101.68,62.05 J4.5
N$1
  Top 0.4: U5.3 112.09,45.09
  Top 0.5: R12.1 TP12.TP 112.09,45.09
N$2
  Top 0.75: LED2.A R10.2
N$3
  Top 0.75: Q3.3 100.5,39 | 100.5,39 100.5,35.5 K4.2 | 100.5,39 102,39 104,41 D7.2
N$4
  Top 0.75: Q3.1 101.45,42.3 LED4.C
N$5
  Top 0.75: Q4.1 118.45,42.3 LED5.C
N$6
  Top 0.75: Q4.3 117.5,39 | 117.5,39 117.5,35.5 K5.2 | D8.2 121.5,41 119.5,39 117.5,39
N$7
  Top 0.75: LED3.A R11.2
N$8
  Top 0.75: LED4.A R12.2
N$9
  Top 0.5: R9.2 141.5,57 147.43,51.07 U8.1
N$10
  Top 0.5: R8.2 127.5,54.5 130.93,51.07 U7.1
N$11
  Top 0.5: C2.1 27.05,51.25 26.5,51.8 25.89,51.8 U3.5 R2.2 25.75,47.75 25.12,47.12 K1.3
  Top 1: 28.3,49.75 L1.1 | R2.2 25.8,49.75 28.3,49.75 | C2.1 28.3,49.75
N$12
  Top 0.75: LED5.A R13.2
N$13
  Top 0.4: U8.3 161.97,48.53 163,47.5 TP15.TP
  Top 0.75: TP15.TP R11.1
N$14
  Top 0.4: U7.3 145.67,48.53 147,47.2 TP14.TP
  Top 0.5: TP14.TP R10.1
N$15
  Top 0.5: R6.2 99.5,49.5 101.07,51.07 U5.1
N$19
  Top 0.4: U6.3 127.67,48.53 129,47.2 TP13.TP
  Top 0.5: R13.1 TP13.TP
N$21
  Top 0.5: R3.2 14.85,8.17 LED1.A
N$24
  Top 0.75: U1.2 10,47.5 9.5,48 J2.1
N$25
  Top 0.75: K2.2 132.51,36.01 134.5,38 134.5,39 | 134.5,39 Q1.3 | 134.5,39 136,39 138,41 D5.2
N$28
  Top 0.5: R7.2 114,52 114.93,51.07 U6.1
N$29
  Top 0.75: Q1.1 135.45,42.3 LED2.C
N$31
  Top 0.75: LED3.C 149.75,44.7 Q2.1
N$32
  Top 0.75: Q2.3 151.5,39 | 151.5,39 151.5,35.5 K3.2 | 151.5,39 153,39 155,41 D6.2
NC1
  Bottom 4: K4.4 110.49,10.41 J6.1
NC2
  Bottom 4: K5.4 127.49,10.41 J7.1
NC3
  Bottom 4: K2.4 144.49,10.41 J8.1
NC4
  Bottom 4: K3.4 161.49,10.41 J9.1
NO1
  Bottom 4: K4.3 98.51,10.41 J6.3
NO2
  Bottom 4: K5.3 115.51,10.41 J7.3
NO3
  Bottom 4: K2.3 132.51,10.41 J8.3
NO4
  Bottom 4: K3.3 149.51,10.41 J9.3
OUT
  pour Top (no thermals): 17.3,22.4 17.3,21.1 25.6,21.1 25.9,21.4 39.8,21.4 39.8,26.3 28.1,26.3 27.4,25.6 24.4,25.6 21.2,22.4
RX  (via drill 0.35)
  Top 0.5: v74,47.5 74,20.16 67.27,13.43 U10.14 62.43,13.43 55.23,6.23 JP6.3
  Bottom 0.5: v74,47.5 74,57.5 75.85,59.35 109.64,59.35 111.84,61.55 J4.3
SCK
  Top 0.5: U10.11 65.72,21 63,21 60.92,23.08 JP8.6
  Bottom 0.5: JP8.6 60.5,28.54 60.5,47.62 74.19,61.3 95.36,61.3 96.6,62.55 J4.6
SCL
  Bottom 0.5: JP5.3 93.38,10.89 U10.18 82.84,14.14 82.84,37.64 99.05,53.85 136.97,53.85 138.66,55.54 J5.4
SDA
  Bottom 0.5: JP5.2 93.38,8.35 U10.17 82.19,12.25 82.19,37.91 98.78,54.5 132.4,54.5 133.58,55.68 J5.5
SHDN
  Top 0.5: U3.4 R2.1 23.85,48.35 20.5,45 20.5,42 22,40.5 24.5,40.5 25.12,39.88 K1.7
SW
  Top 0.5: U3.1 25.8,54.5 26.4,54.5 27.05,55.15 D4.1
  Top 1: D4.1 29.15,55.15 29.85,54.45 L1.2
TX  (via drill 0.35)
  Top 0.5: v75,48 75.15,47.85 75.15,20.27 U10.15 62.16,10.89 57.77,6.5 JP6.2
  Bottom 0.5: J4.2 116.92,61.05 114.56,58.7 76.12,58.7 75,57.58 v75,48
VIN  (via drill 0.35)
  Top 0.5: U1.1 14.5,47.5 15,48 v15,48.5
  Top 1: v15,48.5 15,49 13.92,50.08 R1.1 | v15,29.7 17.5,32.2 K1.5
  Bottom 1: v22.5,20 15,27.5 v15,29.7 v15,48.5
  pour Top (no thermals): 17.3,20.7 17.3,12.9 22.5,12.9 22.5,15.3 25.4,18.2 31.5,18.2 31.5,21 26,21 25.7,20.7
VIN1
  Top 0.75: K1.2 22.58,42.42 23,42 31.5,42 41,51.5 77,51.5 86.09,42.41 U10.28

### Text on the board
tPlace: SUPPLY 12V DC ONLY! | A0 | A1 | A2 | A3 | A4 | A5 | BRPBARS4CHV00 | SCK | MO | MI | RX | TX | +5V | GND | SDA | SCL | D2 | D3 | D4 | 3V3 | GND | SIGNAL | A0 | A1 | A2 | A3 | A4 | A5 | SCK | MO | MI | COM = COMMON | D4 | NO = NORMALLY OPEN | NC = NORMALLY CLOSED | RELAY1 (D5) | RELAY2 (D6) | RELAY3 (D7) | RELAY4 (D8) | D3 | GND | MOUNT USING M4 HARDWARE | D2 | SCL | H1 | H2 | H3 | SDA | H4 | +5V | H5 | GND | RX | TX | +5V | NO | COM | NC | NO | COM | NC | NO | COM | NC | NO | COM | NC
_tPlace: U10 | U4
_tNames: J3 | J4 | J5 | J2 | C5 | D4 | TP11 | R9 | R5 | L1 | TP10 | U3 | R8 | C4 | TP9 | R7 | R4 | R1 | TP8 | C2 | R6 | U5 | U6 | U7 | U8 | R2 | C6 | LED4 | LED5 | LED2 | LED3 | R12 | TP12 | R13 | TP13 | R10 | TP14 | R11 | TP15 | U1 | TP1 | D7 | D8 | D5 | D6 | Q3 | Q4 | Q1 | Q2 | K1 | TP2 | C3 | TP3 | K4 | K5 | K2 | K3 | C7 | L2 | D3 | U2 | D1 | D2 | P1 | J6 | J7 | J8 | J9 | C1 | R3 | LED1 | J1